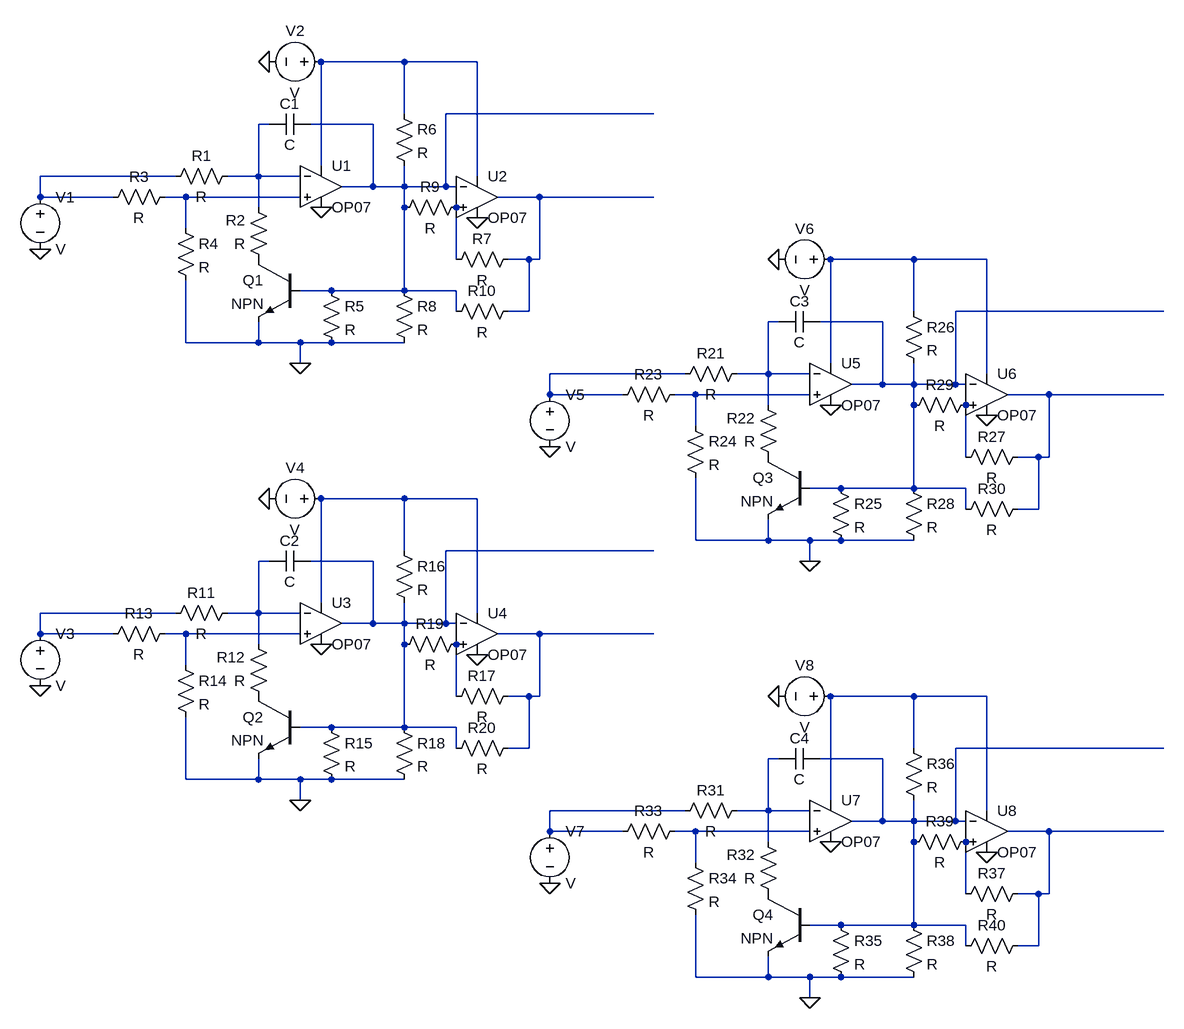
[diagram p0: schematic improved dual untuned audio TRIANGLE and SQUARE vco.asc]
improved dual untuned audio TRIANGLE and SQUARE vco.asc, the LTspice schematic file:
Version 4.1
SHEET 1 1460 1380
WIRE 288 -80 160 -80
WIRE 400 -80 288 -80
WIRE 288 0 288 -80
WIRE 672 0 352 0
WIRE 80 16 64 16
WIRE 240 16 144 16
WIRE 160 80 160 -80
WIRE -64 96 -272 96
WIRE 64 96 64 16
WIRE 64 96 16 96
WIRE 128 96 64 96
WIRE 400 96 400 -80
WIRE 240 112 240 16
WIRE 240 112 192 112
WIRE 288 112 288 80
WIRE 288 112 240 112
WIRE 352 112 352 0
WIRE 352 112 288 112
WIRE 368 112 352 112
WIRE -272 128 -272 96
WIRE -160 128 -272 128
WIRE -48 128 -80 128
WIRE 128 128 -48 128
WIRE 496 128 432 128
WIRE 672 128 496 128
WIRE 64 144 64 96
WIRE 288 144 288 112
WIRE -48 176 -48 128
WIRE 368 224 368 144
WIRE 480 224 448 224
WIRE 496 224 496 128
WIRE 496 224 480 224
WIRE 1072 224 944 224
WIRE 1184 224 1072 224
WIRE 176 272 128 272
WIRE 288 272 288 144
WIRE 288 272 176 272
WIRE 368 272 288 272
WIRE 368 304 368 272
WIRE 480 304 480 224
WIRE 480 304 448 304
WIRE 1072 304 1072 224
WIRE 1456 304 1136 304
WIRE 864 320 848 320
WIRE 1024 320 928 320
WIRE -48 352 -48 256
WIRE 64 352 64 320
WIRE 64 352 -48 352
WIRE 128 352 64 352
WIRE 176 352 128 352
WIRE 288 352 176 352
WIRE 128 384 128 352
WIRE 944 384 944 224
WIRE 720 400 512 400
WIRE 848 400 848 320
WIRE 848 400 800 400
WIRE 912 400 848 400
WIRE 1184 400 1184 224
WIRE 1024 416 1024 320
WIRE 1024 416 976 416
WIRE 1072 416 1072 384
WIRE 1072 416 1024 416
WIRE 1136 416 1136 304
WIRE 1136 416 1072 416
WIRE 1152 416 1136 416
WIRE 512 432 512 400
WIRE 624 432 512 432
WIRE 736 432 704 432
WIRE 912 432 736 432
WIRE 1280 432 1216 432
WIRE 1456 432 1280 432
WIRE 848 448 848 400
WIRE 1072 448 1072 416
WIRE 736 480 736 432
WIRE 1152 528 1152 448
WIRE 1264 528 1232 528
WIRE 1280 528 1280 432
WIRE 1280 528 1264 528
WIRE 960 576 912 576
WIRE 1072 576 1072 448
WIRE 1072 576 960 576
WIRE 1152 576 1072 576
WIRE 288 592 160 592
WIRE 400 592 288 592
WIRE 1152 608 1152 576
WIRE 1264 608 1264 528
WIRE 1264 608 1232 608
WIRE 736 656 736 560
WIRE 848 656 848 624
WIRE 848 656 736 656
WIRE 912 656 848 656
WIRE 960 656 912 656
WIRE 1072 656 960 656
WIRE 288 672 288 592
WIRE 672 672 352 672
WIRE 80 688 64 688
WIRE 240 688 144 688
WIRE 912 688 912 656
WIRE 160 752 160 592
WIRE -64 768 -272 768
WIRE 64 768 64 688
WIRE 64 768 16 768
WIRE 128 768 64 768
WIRE 400 768 400 592
WIRE 240 784 240 688
WIRE 240 784 192 784
WIRE 288 784 288 752
WIRE 288 784 240 784
WIRE 352 784 352 672
WIRE 352 784 288 784
WIRE 368 784 352 784
WIRE -272 800 -272 768
WIRE -160 800 -272 800
WIRE -48 800 -80 800
WIRE 128 800 -48 800
WIRE 496 800 432 800
WIRE 672 800 496 800
WIRE 64 816 64 768
WIRE 288 816 288 784
WIRE -48 848 -48 800
WIRE 368 896 368 816
WIRE 480 896 448 896
WIRE 496 896 496 800
WIRE 496 896 480 896
WIRE 1072 896 944 896
WIRE 1184 896 1072 896
WIRE 176 944 128 944
WIRE 288 944 288 816
WIRE 288 944 176 944
WIRE 368 944 288 944
WIRE 368 976 368 944
WIRE 480 976 480 896
WIRE 480 976 448 976
WIRE 1072 976 1072 896
WIRE 1456 976 1136 976
WIRE 864 992 848 992
WIRE 1024 992 928 992
WIRE -48 1024 -48 928
WIRE 64 1024 64 992
WIRE 64 1024 -48 1024
WIRE 128 1024 64 1024
WIRE 176 1024 128 1024
WIRE 288 1024 176 1024
WIRE 128 1056 128 1024
WIRE 944 1056 944 896
WIRE 720 1072 512 1072
WIRE 848 1072 848 992
WIRE 848 1072 800 1072
WIRE 912 1072 848 1072
WIRE 1184 1072 1184 896
WIRE 1024 1088 1024 992
WIRE 1024 1088 976 1088
WIRE 1072 1088 1072 1056
WIRE 1072 1088 1024 1088
WIRE 1136 1088 1136 976
WIRE 1136 1088 1072 1088
WIRE 1152 1088 1136 1088
WIRE 512 1104 512 1072
WIRE 624 1104 512 1104
WIRE 736 1104 704 1104
WIRE 912 1104 736 1104
WIRE 1280 1104 1216 1104
WIRE 1456 1104 1280 1104
WIRE 848 1120 848 1072
WIRE 1072 1120 1072 1088
WIRE 736 1152 736 1104
WIRE 1152 1200 1152 1120
WIRE 1264 1200 1232 1200
WIRE 1280 1200 1280 1104
WIRE 1280 1200 1264 1200
WIRE 960 1248 912 1248
WIRE 1072 1248 1072 1120
WIRE 1072 1248 960 1248
WIRE 1152 1248 1072 1248
WIRE 1152 1280 1152 1248
WIRE 1264 1280 1264 1200
WIRE 1264 1280 1232 1280
WIRE 736 1328 736 1232
WIRE 848 1328 848 1296
WIRE 848 1328 736 1328
WIRE 912 1328 848 1328
WIRE 960 1328 912 1328
WIRE 1072 1328 960 1328
WIRE 912 1360 912 1328
FLAG -272 208 0
FLAG 80 -80 0
FLAG 128 384 0
FLAG 160 144 0
FLAG 400 160 0
FLAG -272 880 0
FLAG 80 592 0
FLAG 128 1056 0
FLAG 160 816 0
FLAG 400 832 0
FLAG 512 512 0
FLAG 864 224 0
FLAG 912 688 0
FLAG 944 448 0
FLAG 1184 464 0
FLAG 512 1184 0
FLAG 864 896 0
FLAG 912 1360 0
FLAG 944 1120 0
FLAG 1184 1136 0
SYMBOL OpAmps\\OP07 160 48 R0
SYMATTR InstName U1
SYMBOL OpAmps\\OP07 400 64 R0
SYMATTR InstName U2
SYMBOL res 32 80 R90
WINDOW 0 0 56 VBottom 2
WINDOW 3 32 56 VTop 2
SYMATTR InstName R1
SYMBOL res 80 240 R180
WINDOW 0 36 76 Left 2
WINDOW 3 36 40 Left 2
SYMATTR InstName R2
SYMBOL cap 144 0 R90
WINDOW 0 0 32 VBottom 2
WINDOW 3 32 32 VTop 2
SYMATTR InstName C1
SYMBOL res -64 112 R90
WINDOW 0 0 56 VBottom 2
WINDOW 3 32 56 VTop 2
SYMATTR InstName R3
SYMBOL res -64 160 R0
SYMATTR InstName R4
SYMBOL voltage -272 112 R0
SYMATTR InstName V1
SYMBOL npn 128 224 M0
SYMATTR InstName Q1
SYMBOL res 160 256 R0
SYMATTR InstName R5
SYMBOL res 272 -16 R0
SYMATTR InstName R6
SYMBOL voltage 176 -80 R90
WINDOW 0 -32 56 VBottom 2
WINDOW 3 32 56 VTop 2
SYMATTR InstName V2
SYMBOL res 464 208 R90
WINDOW 0 0 56 VBottom 2
WINDOW 3 32 56 VTop 2
SYMATTR InstName R7
SYMBOL res 272 256 R0
SYMATTR InstName R8
SYMBOL res 384 128 R90
WINDOW 0 0 56 VBottom 2
WINDOW 3 32 56 VTop 2
SYMATTR InstName R9
SYMBOL res 464 288 R90
WINDOW 0 0 56 VBottom 2
WINDOW 3 32 56 VTop 2
SYMATTR InstName R10
SYMBOL OpAmps\\OP07 160 720 R0
SYMATTR InstName U3
SYMBOL OpAmps\\OP07 400 736 R0
SYMATTR InstName U4
SYMBOL res 32 752 R90
WINDOW 0 0 56 VBottom 2
WINDOW 3 32 56 VTop 2
SYMATTR InstName R11
SYMBOL res 80 912 R180
WINDOW 0 36 76 Left 2
WINDOW 3 36 40 Left 2
SYMATTR InstName R12
SYMBOL cap 144 672 R90
WINDOW 0 0 32 VBottom 2
WINDOW 3 32 32 VTop 2
SYMATTR InstName C2
SYMBOL res -64 784 R90
WINDOW 0 0 56 VBottom 2
WINDOW 3 32 56 VTop 2
SYMATTR InstName R13
SYMBOL res -64 832 R0
SYMATTR InstName R14
SYMBOL voltage -272 784 R0
SYMATTR InstName V3
SYMBOL npn 128 896 M0
SYMATTR InstName Q2
SYMBOL res 160 928 R0
SYMATTR InstName R15
SYMBOL res 272 656 R0
SYMATTR InstName R16
SYMBOL voltage 176 592 R90
WINDOW 0 -32 56 VBottom 2
WINDOW 3 32 56 VTop 2
SYMATTR InstName V4
SYMBOL res 464 880 R90
WINDOW 0 0 56 VBottom 2
WINDOW 3 32 56 VTop 2
SYMATTR InstName R17
SYMBOL res 272 928 R0
SYMATTR InstName R18
SYMBOL res 384 800 R90
WINDOW 0 0 56 VBottom 2
WINDOW 3 32 56 VTop 2
SYMATTR InstName R19
SYMBOL res 464 960 R90
WINDOW 0 0 56 VBottom 2
WINDOW 3 32 56 VTop 2
SYMATTR InstName R20
SYMBOL OpAmps\\OP07 944 352 R0
SYMATTR InstName U5
SYMBOL OpAmps\\OP07 1184 368 R0
SYMATTR InstName U6
SYMBOL res 816 384 R90
WINDOW 0 0 56 VBottom 2
WINDOW 3 32 56 VTop 2
SYMATTR InstName R21
SYMBOL res 864 544 R180
WINDOW 0 36 76 Left 2
WINDOW 3 36 40 Left 2
SYMATTR InstName R22
SYMBOL cap 928 304 R90
WINDOW 0 0 32 VBottom 2
WINDOW 3 32 32 VTop 2
SYMATTR InstName C3
SYMBOL res 720 416 R90
WINDOW 0 0 56 VBottom 2
WINDOW 3 32 56 VTop 2
SYMATTR InstName R23
SYMBOL res 720 464 R0
SYMATTR InstName R24
SYMBOL voltage 512 416 R0
SYMATTR InstName V5
SYMBOL npn 912 528 M0
SYMATTR InstName Q3
SYMBOL res 944 560 R0
SYMATTR InstName R25
SYMBOL res 1056 288 R0
SYMATTR InstName R26
SYMBOL voltage 960 224 R90
WINDOW 0 -32 56 VBottom 2
WINDOW 3 32 56 VTop 2
SYMATTR InstName V6
SYMBOL res 1248 512 R90
WINDOW 0 0 56 VBottom 2
WINDOW 3 32 56 VTop 2
SYMATTR InstName R27
SYMBOL res 1056 560 R0
SYMATTR InstName R28
SYMBOL res 1168 432 R90
WINDOW 0 0 56 VBottom 2
WINDOW 3 32 56 VTop 2
SYMATTR InstName R29
SYMBOL res 1248 592 R90
WINDOW 0 0 56 VBottom 2
WINDOW 3 32 56 VTop 2
SYMATTR InstName R30
SYMBOL OpAmps\\OP07 944 1024 R0
SYMATTR InstName U7
SYMBOL OpAmps\\OP07 1184 1040 R0
SYMATTR InstName U8
SYMBOL res 816 1056 R90
WINDOW 0 0 56 VBottom 2
WINDOW 3 32 56 VTop 2
SYMATTR InstName R31
SYMBOL res 864 1216 R180
WINDOW 0 36 76 Left 2
WINDOW 3 36 40 Left 2
SYMATTR InstName R32
SYMBOL cap 928 976 R90
WINDOW 0 0 32 VBottom 2
WINDOW 3 32 32 VTop 2
SYMATTR InstName C4
SYMBOL res 720 1088 R90
WINDOW 0 0 56 VBottom 2
WINDOW 3 32 56 VTop 2
SYMATTR InstName R33
SYMBOL res 720 1136 R0
SYMATTR InstName R34
SYMBOL voltage 512 1088 R0
SYMATTR InstName V7
SYMBOL npn 912 1200 M0
SYMATTR InstName Q4
SYMBOL res 944 1232 R0
SYMATTR InstName R35
SYMBOL res 1056 960 R0
SYMATTR InstName R36
SYMBOL voltage 960 896 R90
WINDOW 0 -32 56 VBottom 2
WINDOW 3 32 56 VTop 2
SYMATTR InstName V8
SYMBOL res 1248 1184 R90
WINDOW 0 0 56 VBottom 2
WINDOW 3 32 56 VTop 2
SYMATTR InstName R37
SYMBOL res 1056 1232 R0
SYMATTR InstName R38
SYMBOL res 1168 1104 R90
WINDOW 0 0 56 VBottom 2
WINDOW 3 32 56 VTop 2
SYMATTR InstName R39
SYMBOL res 1248 1264 R90
WINDOW 0 0 56 VBottom 2
WINDOW 3 32 56 VTop 2
SYMATTR InstName R40

The netlist it stands for:
* improved dual untuned audio TRIANGLE and SQUARE vco.asc
X§U1 N005 N003 N001 0 N002 LT1001  ; OP07, pins In+ In- V+ V- OUT
X§U2 N007 N002 N001 0 N006 LT1001  ; OP07, pins In+ In- V+ V- OUT
R1 N003 N004 R
R2 P001 N003 R
C1 N002 N003 C
R3 N005 N004 R
R4 N005 0 R
V1 N004 0 V
Q1 P001 N002 0 0 NPN
R5 N002 0 R
R6 N001 N002 R
V2 N001 0 V
R7 N006 N007 R
R8 N002 0 R
R9 N007 N002 R
R10 N006 N002 R
X§U3 N019 N017 N015 0 N016 LT1001  ; OP07, pins In+ In- V+ V- OUT
X§U4 N021 N016 N015 0 N020 LT1001  ; OP07, pins In+ In- V+ V- OUT
R11 N017 N018 R
R12 P002 N017 R
C2 N016 N017 C
R13 N019 N018 R
R14 N019 0 R
V3 N018 0 V
Q2 P002 N016 0 0 NPN
R15 N016 0 R
R16 N015 N016 R
V4 N015 0 V
R17 N020 N021 R
R18 N016 0 R
R19 N021 N016 R
R20 N020 N016 R
X§U5 N012 N010 N008 0 N009 LT1001  ; OP07, pins In+ In- V+ V- OUT
X§U6 N014 N009 N008 0 N013 LT1001  ; OP07, pins In+ In- V+ V- OUT
R21 N010 N011 R
R22 P003 N010 R
C3 N009 N010 C
R23 N012 N011 R
R24 N012 0 R
V5 N011 0 V
Q3 P003 N009 0 0 NPN
R25 N009 0 R
R26 N008 N009 R
V6 N008 0 V
R27 N013 N014 R
R28 N009 0 R
R29 N014 N009 R
R30 N013 N009 R
X§U7 N026 N024 N022 0 N023 LT1001  ; OP07, pins In+ In- V+ V- OUT
X§U8 N028 N023 N022 0 N027 LT1001  ; OP07, pins In+ In- V+ V- OUT
R31 N024 N025 R
R32 P004 N024 R
C4 N023 N024 C
R33 N026 N025 R
R34 N026 0 R
V7 N025 0 V
Q4 P004 N023 0 0 NPN
R35 N023 0 R
R36 N022 N023 R
V8 N022 0 V
R37 N027 N028 R
R38 N023 0 R
R39 N028 N023 R
R40 N027 N023 R
.model NPN NPN
.model PNP PNP
.lib standard.bjt
.lib LTC.lib
.backanno
.end